# EAGLE design S7G2_IO_Test_Platform (EAGLE 9.6.2)
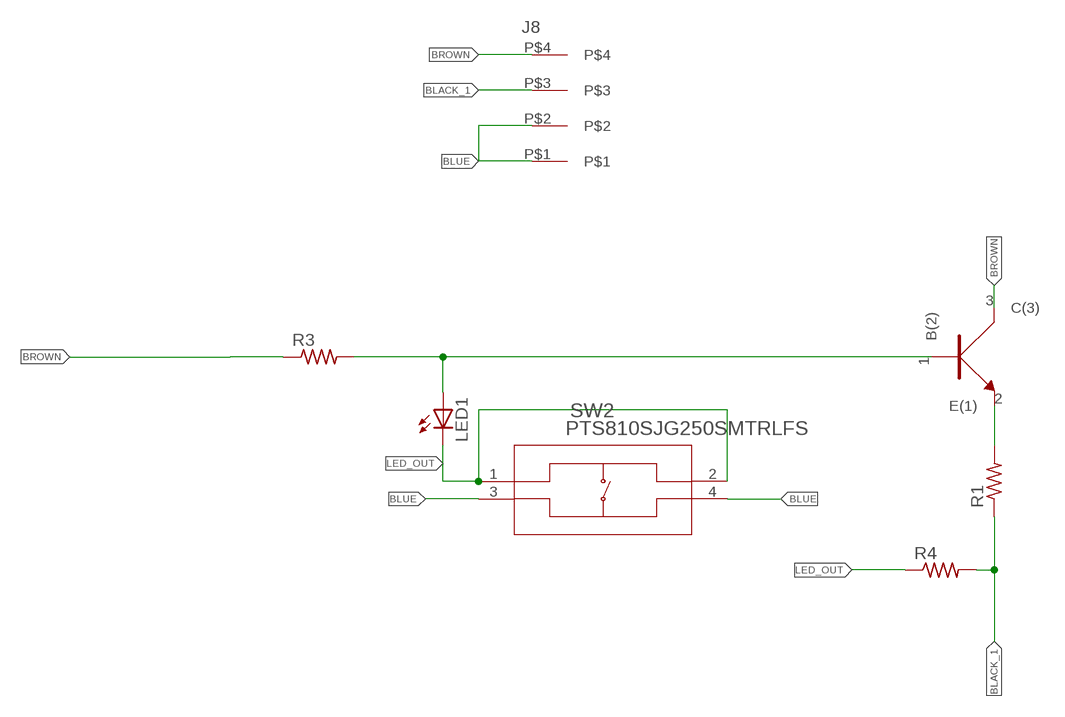
[diagram p0: schematic, sheet 1]

## Parts
J8  4-pos  3.81MM_1_X_4_RT_ANGLE_PLUG_HEADER  [1X4_3.81MM_PITCH]
LED1  Green  LED_0805_GREEN  [0805]
R1  R_0805  [0805]
R3  R_0805  [0805]
R4  R_0805  [0805]
SW2  PTS810SJG250SMTRLFS  [PTS810]
U1  NPN  BC846BW  [SOT323]

## Nets
BLACK_1: J8.P$3 R1.1 R4.2
BLUE: J8.P$1 J8.P$2 SW2.3 SW2.4
BROWN: J8.P$4 R3.1 U1.3(C(3))
LED_OUT: LED1.2(C) R4.1 SW2.1 SW2.2
N$1: LED1.1(A) R3.2 U1.1(B(2))
N$7: R1.2 U1.2(E(1))

## Library data of the parts
J8 = 3D_MIG_Controller:3.81MM_1_X_4_RT_ANGLE_PLUG_HEADER: 4 Position Terminal Block Header, Male Pins, Shrouded (4 Side) 0.150" (3.81mm) 90°, Right Angle - Through Hole; PARTNO: 691322310004
LED1 = 3D_MIG_Controller:LED_0805_GREEN: Green 570nm LED Indication - Discrete 2.2V 0805 (2012 Metric); PARTNO: LG R971-KN-1
R1 R3 R4 = 3D_MIG_Controller:R_0805
SW2 = 3D_MIG_Controller:PTS810SJG250SMTRLFS; BUILT_BY: EMA_Cory; COPYRIGHT: Copyright (C) 2018 Accelerated Designs. All rights reserved; DATASHEET: https://www.ckswitches.com/products/tactile/PTS810/#PTS810SJG250SMTRLFS; MANUFACTURER_PART_NUMBER: PTS810SJG250SMTRLFS; VENDOR: C&K
U1 = 3D_MIG_Controller:BC846BW: Bipolar (BJT) Transistor NPN 100MHz Surface Mount SOT-323; PARTNO: BC846BW_NPN

## Board
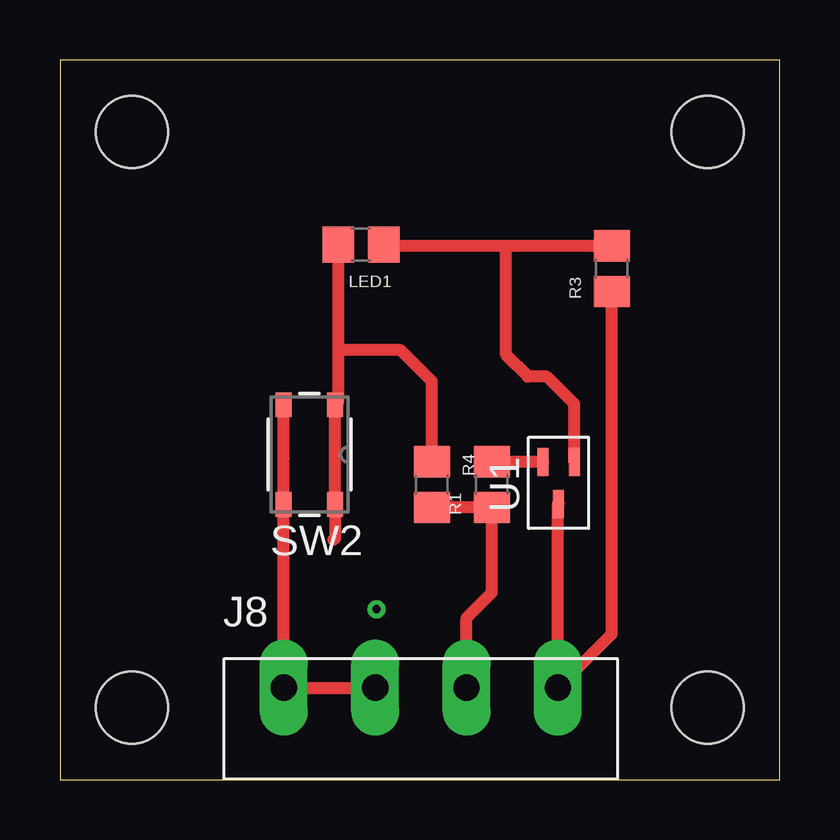
[diagram p1: board, top side]

Size 30 x 30 mm. Coordinates in mm from the lower left corner, seen from the top.
Outline: 0,0 30,0 30,30 0,30 0,0
Copper layers (1*16): Top 0.035mm / dielectric 1.5mm / Bottom 0.035mm
Design rules "default": minimum track width 6mil, minimum drill 0.35mm, track to track 6mil, track to pad 6mil, pad to pad 6mil, via to via 6mil, smd to smd 6mil, copper to edge 40mil, drill to drill 6mil, minimum pad ring 10mil, minimum via ring 8mil, stop-mask expansion 4mil, vias tented up to drill 0mil, thermal gap 10mil
Holes 3 mm at 3,3 3,27 27,27 27,3

### Footprints (pad centres in the part's own frame; a part is rotated, then mirrored left to right if it is on the bottom)
1X4_3.81MM_PITCH = drill 1.1 pad 2 long: P$1 0,0; P$2 3.81,0; P$3 7.62,0; P$4 11.43,0
0805 = smd 1.3 x 1.5: 1 -0.95,0; 2 0.95,0
PTS810 = smd 1.041 x 0.66: 1 -2.075,1.075; 2 2.075,1.075; 3 -2.075,-1.075; 4 2.075,-1.075
SOT323 = smd 0.457 x 1.168: 1 -0.65,-0.876; 2 0.65,-0.876; 3 0,0.876

### Placement (x,y rotation side)
J8  9.33,3.83 0 top
LED1  12.55,22.3 180 top
R1  18,12.3 90 top
R3  23,21.3 90 top
R4  15.5,12.3 270 top
SW2  10.4,13.55 270 top
U1  20.79,12.37 180 top

### Tracks (layer width: path | path; a pad name or v marks a point on that pad's centre or on a via)
BLACK_1
  Top 0.508: J8.P$3 16.95,6.75 18,7.8 R1.1 R4.2
BLUE
  Top 0.508: SW2.4 9.32,13.4 | 9.32,13.4 SW2.3 | 9.32,13.4 9.33,13.39 J8.P$1 J8.P$2
BROWN
  Top 0.508: U1.3 20.76,11.46 J8.P$4 23,6.07 R3.1
LED_OUT
  Top 0.508: LED1.2 11.6,17.9 | 11.6,17.9 11.6,15.75 SW2.1 SW2.2 11.47,10.07 11.4,10 | R4.1 15.5,16.6 14.2,17.9 11.6,17.9
N$1
  Top 0.508: LED1.1 13.55,22.25 18.6,22.25 | U1.1 21.44,15.66 20.3,16.8 19.5,16.8 18.6,17.7 18.6,22.25 | R3.2 18.6,22.25
N$4  (via drill 0.35)
  other vias: 13.2,7.1
N$7
  Top 0.508: U1.2 R1.2